# Altium project Speedometer_Tech.PrjPcb
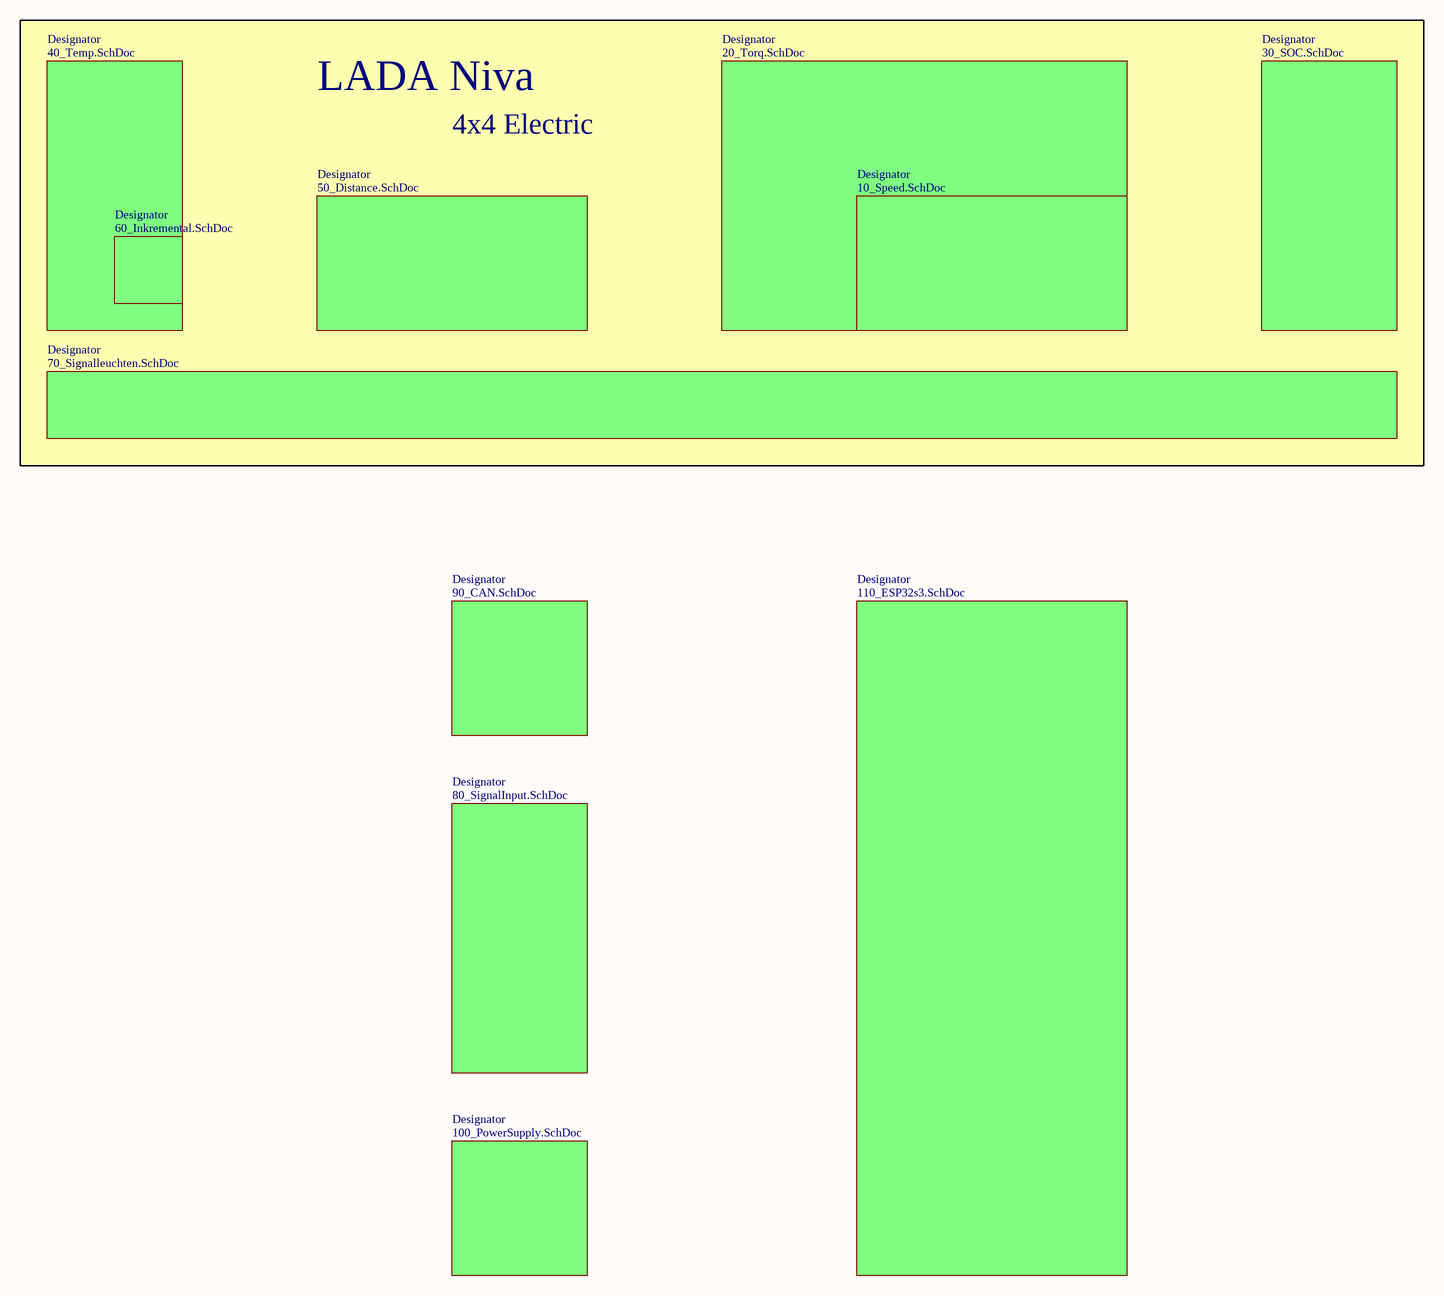
[diagram p0: 00_Overview.SchDoc]
7 sheets, 43 parts. Net scope: flat (ports and power ports of the same name join across sheets).
Board file: Speedometer_Tech.PcbDoc
Sheets:
  00_Overview.SchDoc
    Designator = 110_ESP32s3.SchDoc
    Designator = 10_Speed.SchDoc
    Designator = 40_Temp.SchDoc
    Designator = 50_Distance.SchDoc
    Designator = 100_PowerSupply.SchDoc
    Designator = 90_CAN.SchDoc

## Sheet 00_Overview.SchDoc
size A3; SheetNumber: 1; SheetTotal: 12

### Sub-sheets
Designator = 110_ESP32s3.SchDoc: no entries
Designator = 20_Torq.SchDoc (file not in this document): no entries
Designator = 10_Speed.SchDoc: no entries
Designator = 30_SOC.SchDoc (file not in this document): no entries
Designator = 40_Temp.SchDoc: no entries
Designator = 70_Signalleuchten.SchDoc (file not in this document): no entries
Designator = 50_Distance.SchDoc: no entries
Designator = 60_Inkremental.SchDoc (file not in this document): no entries
Designator = 80_SignalInput.SchDoc (file not in this document): no entries
Designator = 100_PowerSupply.SchDoc: no entries
Designator = 90_CAN.SchDoc: no entries

### Notes on the sheet
- LADA Niva
- 4x4 Electric

## Sheet 110_ESP32s3.SchDoc
size A4; SheetNumber: 12; SheetTotal: 12
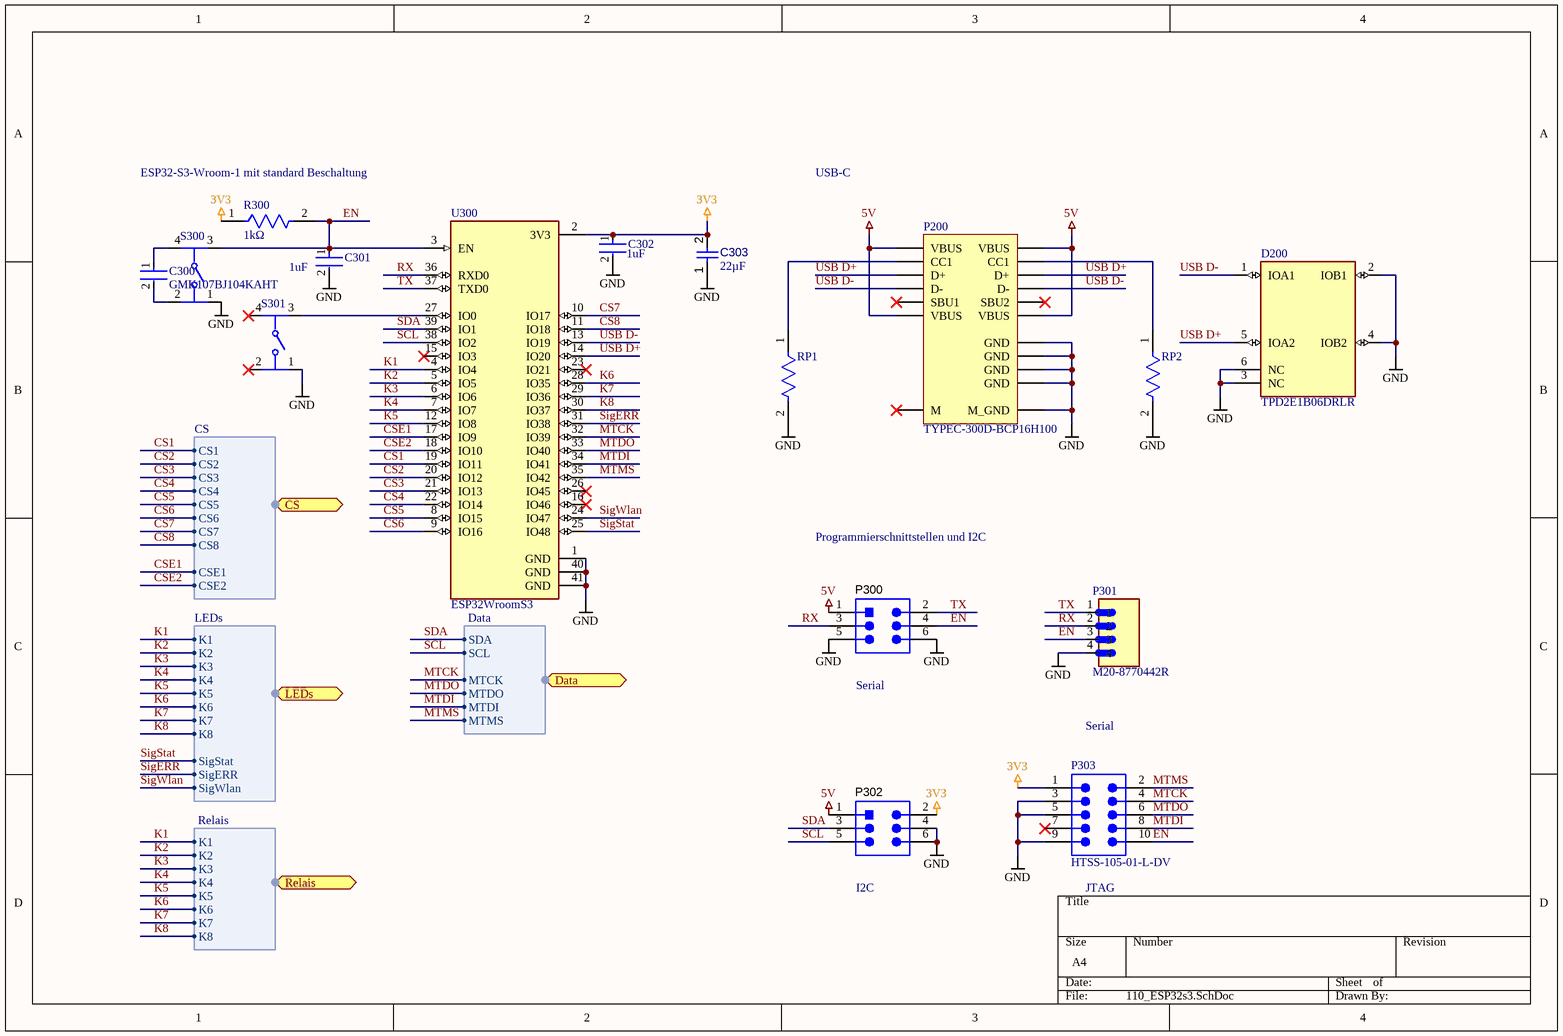
[diagram p1: 110_ESP32s3.SchDoc]

### Parts
C300  GMK107BJ104KAHT  [FP-0603-L_1_6_0_1-W_0_8_0-IPC_B]
C301  1uF  [FP-CGA3E-0_3-0_1-MFG]
C302  1uF  [FP-CGA3E-0_3-0_1-MFG]
C303  value 22µF  [CAPC0805(2012)145_L]  (hidden comment: Capacitor 22µF +/-40% 16V 0805)
D200  TPD2E1B06DRLR  [FP-DRL0006A-MFG]
P200  TYPEC-300D-BCP16H100  [TYPEC-300D-BCP16H100-Footprint-1]
P300  5-146130-2  [TECO-5-146130-2_V]  (value not drawn)
P301  M20-8770442R  [HARWIN_M20-8770442R]
P302  5-146130-2  [TECO-5-146130-2_V]  (value not drawn)
P303  HTSS-105-01-L-DV  [SMTC-HTSS-105-01-X-DV]
R300  1kΩ  [FP-CRCW0603-e3-MFG]
RP1  CRCW06035K10FKEA  [FP-CRCW0603-e3-IPC_C]  (value not drawn)
RP2  CRCW06035K10FKEA  [FP-CRCW0603-e3-IPC_C]  (value not drawn)
S300  (no value)  [FP-PTS645SM43SMTR92LFS-MFG]
S301  (no value)  [FP-PTS645SM43SMTR92LFS-MFG]
U300  ESP32WroomS3  [ESP32WroomS3]

### Ports
CS (bidir, harness CS), Data (bidir, harness Data), LEDs (bidir, harness LEDs), Relais (bidir, harness Relais)

### Harnesses
Relais: K1, K2, K3, K4, K5, K6, K7, K8
LEDs: K1, K2, K3, K4, K5, K6, K7, K8, SigStat, SigERR, SigWlan
CS: CS1, CS2, CS3, CS4, CS5, CS6, CS7, CS8, CSE1, CSE2
Data: SDA, SCL, MTCK, MTDO, MTDI, MTMS

### Nets
3V3: C302.1 C303.2 P302.2 P303.1 R300.1 U300.2(3V3)
5V: P200.A4(VBUS) P200.A9(VBUS) P200.B4(VBUS) P200.B9(VBUS) P300.1 P302.1
GND: C301.2 C302.2 C303.1 D200.2(IOB1) D200.3(NC) D200.4(IOB2) D200.6(NC) P200.A1(GND) P200.A12(GND) P200.B1(GND) P200.B12(GND) P200.M_GND P300.5 P300.6 P301.4 P302.4 P302.6 P303.3 P303.5 P303.9 RP1.2 RP2.2 S300.1 S301.1 U300.1(GND) U300.40(GND) U300.41(GND)
CS1: U300.19(IO11) ; port CS.CS1
CS2: U300.20(IO12) ; port CS.CS2
CS3: U300.21(IO13) ; port CS.CS3
CS4: U300.22(IO14) ; port CS.CS4
CS5: U300.8(IO15) ; port CS.CS5
CS6: U300.9(IO16) ; port CS.CS6
CS7: U300.10(IO17) ; port CS.CS7
CS8: U300.11(IO18) ; port CS.CS8
CSE1: U300.17(IO9) ; port CS.CSE1
CSE2: U300.18(IO10) ; port CS.CSE2
EN: C301.1 P300.4 P301.3 P303.10 R300.2 S300.3 U300.3(EN)
K1: U300.4(IO4) ; port Relais.K1, port LEDs.K1
K2: U300.5(IO5) ; port Relais.K2, port LEDs.K2
K3: U300.6(IO6) ; port Relais.K3, port LEDs.K3
K4: U300.7(IO7) ; port Relais.K4, port LEDs.K4
K5: U300.12(IO8) ; port Relais.K5, port LEDs.K5
K6: U300.28(IO35) ; port Relais.K6, port LEDs.K6
K7: U300.29(IO36) ; port Relais.K7, port LEDs.K7
K8: U300.30(IO37) ; port Relais.K8, port LEDs.K8
MTCK: P303.4 U300.32(IO39) ; port Data.MTCK
MTDI: P303.8 U300.34(IO41) ; port Data.MTDI
MTDO: P303.6 U300.33(IO40) ; port Data.MTDO
MTMS: P303.2 U300.35(IO42) ; port Data.MTMS
RX: P300.3 P301.2 U300.36(RXD0)
SCL: P302.5 U300.38(IO2) ; port Data.SCL
SDA: P302.3 U300.39(IO1) ; port Data.SDA
SigERR: U300.31(IO38) ; port LEDs.SigERR
SigStat: U300.25(IO48) ; port LEDs.SigStat
SigWlan: U300.24(IO47) ; port LEDs.SigWlan
TX: P300.2 P301.1 U300.37(TXD0)
USB D+: D200.5(IOA2) P200.A6(D+) P200.B6(D+) U300.14(IO20)
USB D-: D200.1(IOA1) P200.A7(D-) P200.B7(D-) U300.13(IO19)
NetC300_1: C300.1 S300.4
NetC300_2: C300.2 S300.2
NetP200_A5: P200.A5(CC1) RP1.1
NetP200_B5: P200.B5(CC1) RP2.1
NetS301_3: S301.3 U300.27(IO0)

Not connected (* = marked no-connect by the designer): P200 A8(SBU1)* B8(SBU2)* M*; P303 7*; S301 2* 4*; U300 15(IO3)* 16(IO46)* 23(IO21)* 26(IO45)*

### Notes on the sheet
- (near R300) ESP32-S3-Wroom-1 mit standard Beschaltung
- USB-C
- Programmierschnittstellen und I2C
- (near P300) Serial
- Serial
- (near P302) I2C
- (near P303) JTAG

### Library data of the parts
C300 = CMP-14477-002194-3: Ceramic Capacitor Automotive 0.1uF ±10% 35V X5R 0603; NexarPartId: 29103042; Capacitance: 100nF; Packaging: Digi-Reel®; Height: 900µm; Width: 800µm; Thickness: 889µm; Min Operating Temperature: -55°C; Termination: SMD/SMT; Mount: Surface Mount; Ratings: AEC-Q200; Halogen Free: Halogen Free; Tolerance: 10%; Max Operating Temperature: 85°C; Case Code (Metric): 1608; Case/Package: 0603; Lead Free: Lead Free; Case Code (Imperial): 0603; Length: 1.6002mm; Voltage Rating: 35V; Voltage Rating (DC): 35V; Dielectric: X5R; Min Width: 700µm; Min Length: 1.5mm; Max Length: 1.7mm; Material: Ceramic; Min Thickness: 700µm; Max Thickness: 900µm; RoHS: Compliant; Max Width: 900µm
C301 C302 = CMP-08246-002551-1: Cap Ceramic 1uF 35V X7R 10% Pad SMD 0603 +125°C Automotive T/R / CGA3E1X7R1V105K080AC; Termination: SMD/SMT; Packaging: Tape and Reel; Capacitance: 1uF; Tolerance: 10%; Mount: Surface Mount; Thickness: 0.035inch; Case Code (Imperial): 0603; Voltage Rating: 35V; Case/Package: 0603; Case Code (Metric): 1608; Dielectric: X7R; Width: 0.031inch; Length: 0.063inch; Min Operating Temperature: -55°C; Weight: 7.1E-05oz; Max Operating Temperature: 125°C; Voltage Rating (DC): 35V; Height: 0.8mm; Ratings: AEC-Q200; Package Quantity: 4000
C303 = CMP-001-00081-4: Chip Capacitor, 22µF +/-40%, 16V, 0805, Thickness 1.45 mm; Tolerance: 5%; Voltage Rating: 16V; Mounting Technology: SMT; Pins: 2; Max Operating Temperature: 85°C; Case/Package: 0805; Min Operating Temperature: -55°C
D200 = CMP-04985-000003-1: TVS DIODE 5.5V 15V 6SOT; Manufacturer: Texas Instruments; Peak Pulse Power: 35W; Peak Pulse Current: 2.5A; Direction: Bidirectional; Standoff Height: 0mm; Interface: I2C,USB,LVDS,Other; Number Of Channels: 2; Breakdown Voltage: 7V; Ambient Temperature Range High: +125°C; Package: DRL0006A; Automotive: No; Lead Free: Yes; Temperature Range Low: -40°C; Reverse Standoff Voltage: 5.5V; Clamping Voltage: 15V; Mouser Description: ESD Suppressors / TVS Diodes 2-CH system level ESD protect device; Temperature Range High: +125°C; Device Class L1: Circuit Protection; ComponentLink2Description: Datasheet; RoHS: TRUE; Ambient Temperature Range Low: -40°C; Height: 0.6mm; Device Class L3: unset; Device Class L2: ESD and Circuit Protection ICs; Temperature: -40°C to +125°C; Octopart: https://octopart.com/tpd2e1b06drlr-texas+instruments-30488860; ComponentLink2URL: http://www.ti.com/lit/ds/symlink/tpd2e1b06.pdf; Category: Diode; Manufacturer Part Number: TPD2E1B06DRLR; Digikey Description: TVS DIODE 5.5V 15V 6SOT
P200 = CMP-002-00081-3: Vertical USB Type C Connector
P300 P302 = CMP-1684-00011-1: Male Header, Pitch 2.54 mm, 2 x 3 Position, Height 8.13 mm, -65 to 125 degC, RoHS, Tube; Max Supply Voltage: 5.5 V; Min Supply Voltage: 4.5 V; Nominal Supply Voltage: 5 V; Min Operating Temperature: -40 degC; ComponentLink1URL: http://www.te.com/; ComponentLink2Description: Datasheet; Pins: 3; Max Operating Temperature: 150 degC; PackageDescription: Male Header, Pitch 2.54 mm, 2 x 3 Position, Height 8.13 mm; Package Quantity: 3000; PackageReference: 5-146130-2; DatasheetVersion: Oct-15; ComponentLink1Description: Manufacturer URL; Radiation Hardening: No; Mount: Surface Mount; RoHSCompliant: true; Packaging: Tape and Reel; ComponentLink2URL: http://www.te.com/commerce/DocumentDelivery/DDEController?Action=showdoc&DocId=Customer+Drawing%7F146130%7FM%7Fpdf%7FEnglish%7FENG_CD_146130_M.pdf%7F5-146130-2
P301 = M20-8770442R: Connector Header Surface Mount 4 position 0.100 (2.54mm); MF: Harwin Inc.; Package: None; Price: None; Check_prices: https://www.snapeda.com/parts/M20-8770442R/Harwin+Inc./view-part/?ref=eda; Value: *; SnapEDA_Link: https://www.snapeda.com/parts/M20-8770442R/Harwin+Inc./view-part/?ref=snap; MP: M20-8770442R; Availability: In Stock; Purchase-URL: https://pricing.snapeda.com/search?q=M20-8770442R&ref=eda
P303 = CMP-1024-00042-1: Shrouded .025" SQ Post Header, Surface Mount, Vertical, -55 to 125 degC, 2.54 mm Pitch, 10-Pin, Male, RoHS; Manufacturer: Samtec; Pitch: 2.54 mm; ComponentLink1URL: http://www.samtec.com; Mounting Technology: Surface Mount; ComponentLink3URL: http://www.samtec.com/documents/webfiles/cpdf/HTSS-1XX-01-XX-DV-X-XX-X-XX-MKT.pdf; ComponentLink2URL: http://www.samtec.com/documents/webfiles/pdf/htss.pdf; ComponentLink3Description: Package Specification; Orientation: Vertical; PackageDescription: High Temp Top Shroud; ComponentLink2Description: Datasheet; PackageVersion: Z, 7/2001; ComponentLink1Description: Manufacturer URL; Temperature Range: -55 to 125 degC; RoHS: True; PackageReference: HTSS-105-01-X-DV; DatasheetVersion: F-214; PartNumber: HTSS-105-01-L-DV
R300 = CMP-1666-00003-5: RES Thick Film, 1kΩ, 1%, 0.1W, 100ppm/°C, 0603, CRCW06031K00FKEA; Max Power Dissipation: 100mW; Voltage Rating: 75V; Resistance: 1kR; Max Operating Temperature: 155°C; Number of Pins: 2; Case Code (Imperial): 0603; Width: 0.033inch; Power Rating: 100mW; Number of Terminations: 2; Package Quantity: 10; Weight: 7.1E-05oz; Tolerance: 1%; Temperature Coefficient: 100ppm/°C; Military Standard: Not; Mount: Surface Mount; Voltage Rating (DC): 75V; Depth: 0.85mm; Composition: Thick Film; Radiation Hardening: No; Termination: SMD/SMT; Length: 1.55mm; Case Code (Metric): 1608; Contact Plating: Tin; Min Operating Temperature: -55°C; Packaging: Tape and Reel; Height: 0.45mm; Lead Free: Lead Free; Case/Package: 0603; Features: Automotive AEC-Q200
RP1 RP2 = CMP-1012-00590-3: RES Thick Film, 5.1kΩ, 1%, 0.1W, 100ppm/°C, 0603; Power Rating: 100mW; Voltage Rating (DC): 75V; Resistance: 5.1kR; Width: 0.85mm; Depth: 0.85mm; Military Standard: Not; Package Quantity: 5000; Case Code (Metric): 1608; Length: 1.55mm; Weight: 7.1E-05oz; Packaging: Tape and Reel; Temperature Coefficient: 100ppm/°C; Case Code (Imperial): 0603; Lead Free: Lead Free; Radiation Hardening: No; Contact Plating: Tin; Composition: Thick Film; Max Operating Temperature: 155°C; Termination: SMD/SMT; Case/Package: 0603; Min Operating Temperature: -55°C; Tolerance: 1%; Voltage Rating: 75V; Mount: Surface Mount; Height: 0.45mm
S300 S301 = CMP-2000-05160-2: SWITCH TACTILE SPST-NO 0.05A 12V / PTS645SM43SMTR92LFS; Contact Resistance: 100mR; Throw Configuration: SPST; Illumination Type: Non-Illuminated; Mechanical Life: 100000Cycles; Current Rating: 50mA; Switch Function: Off-Mom; Actuator Length: 0.85mm; Actuator Material: Nylon; Actuator Type: Standard; Operating Force: 160gf; Min Operating Temperature: -20°C; REACH SVHC: No SVHC; Termination: Gull Wing; Case/Package: SMD/SMT; Packaging: Tape and Reel; Mount: Surface Mount; Voltage Rating (DC): 12V; Orientation: Straight; Lead Free: Lead Free; Contact Material: Silver; Color: Black; Max Current Rating: 50mA; Contact Plating: Silver; Depth: 9mm; Package Quantity: 1; Max Voltage Rating (DC): 12V; Length: 6mm; Max Operating Temperature: 60°C
U300 = CMP-017-000002-1: Design Item ID: ESP32WroomS3; Source: Schaltdose.SchLib

## Sheet 10_Speed.SchDoc
size A3; SheetNumber: 2; SheetTotal: 12
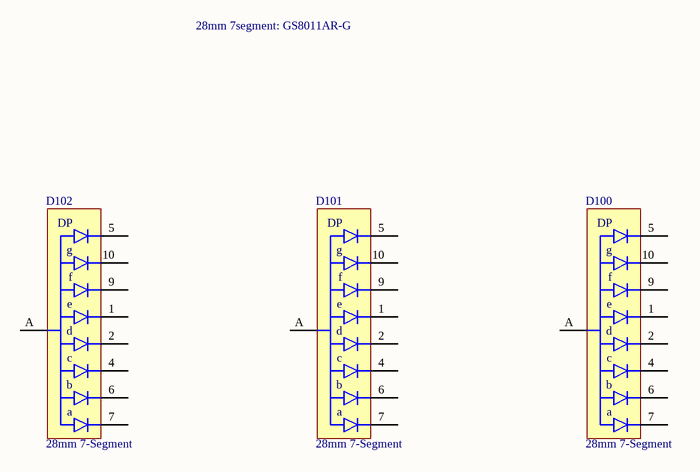
[diagram p2: 10_Speed.SchDoc]

### Parts
D100  28mm 7-Segment  [GS8011AR-G]
D101  28mm 7-Segment  [GS8011AR-G]
D102  28mm 7-Segment  [GS8011AR-G]

### Nets

Not connected (* = marked no-connect by the designer): D100 1 2 4 5 6 7 9 10 A; D101 1 2 4 5 6 7 9 10 A; D102 1 2 4 5 6 7 9 10 A

### Notes on the sheet
- 28mm 7segment: GS8011AR-G

### Library data of the parts
D100-D102 = GS8011AR-G: SMD, 28x16.8mm 7-Segment

## Sheet 40_Temp.SchDoc
size A3; SheetNumber: 5; SheetTotal: 12

## Sheet 50_Distance.SchDoc
size A3; SheetNumber: 6; SheetTotal: 12
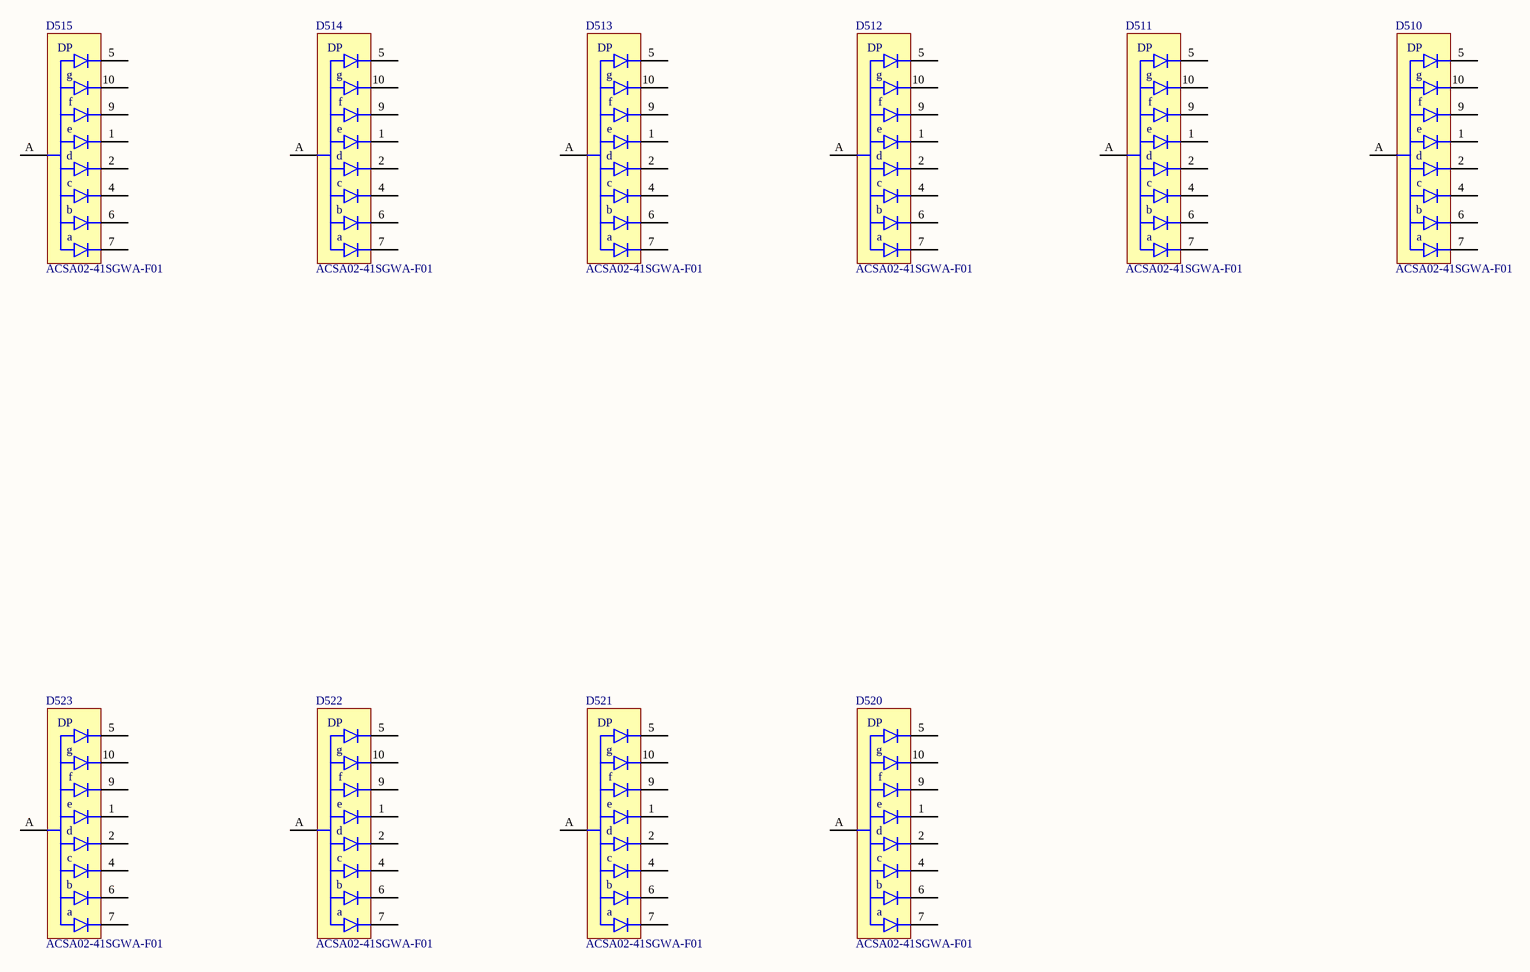
[diagram p3: 50_Distance.SchDoc]

### Parts
D510  ACSA02-41SGWA-F01  [ACSA02-41SGWA-F01]
D511  ACSA02-41SGWA-F01  [ACSA02-41SGWA-F01]
D512  ACSA02-41SGWA-F01  [ACSA02-41SGWA-F01]
D513  ACSA02-41SGWA-F01  [ACSA02-41SGWA-F01]
D514  ACSA02-41SGWA-F01  [ACSA02-41SGWA-F01]
D515  ACSA02-41SGWA-F01  [ACSA02-41SGWA-F01]
D520  ACSA02-41SGWA-F01  [ACSA02-41SGWA-F01]
D521  ACSA02-41SGWA-F01  [ACSA02-41SGWA-F01]
D522  ACSA02-41SGWA-F01  [ACSA02-41SGWA-F01]
D523  ACSA02-41SGWA-F01  [ACSA02-41SGWA-F01]

### Nets

Not connected (* = marked no-connect by the designer): D510 1 2 4 5 6 7 9 10 A; D511 1 2 4 5 6 7 9 10 A; D512 1 2 4 5 6 7 9 10 A; D513 1 2 4 5 6 7 9 10 A; D514 1 2 4 5 6 7 9 10 A; D515 1 2 4 5 6 7 9 10 A; D520 1 2 4 5 6 7 9 10 A; D521 1 2 4 5 6 7 9 10 A; D522 1 2 4 5 6 7 9 10 A; D523 1 2 4 5 6 7 9 10 A

### Notes on the sheet
- (in symbol ACSA02-41SGWA-F01) DP; g; f; e; d; c; b; a

## Sheet 100_PowerSupply.SchDoc
size A3; SheetNumber: 11; SheetTotal: 12

## Sheet 90_CAN.SchDoc
size A4; SheetNumber: 10; SheetTotal: 12
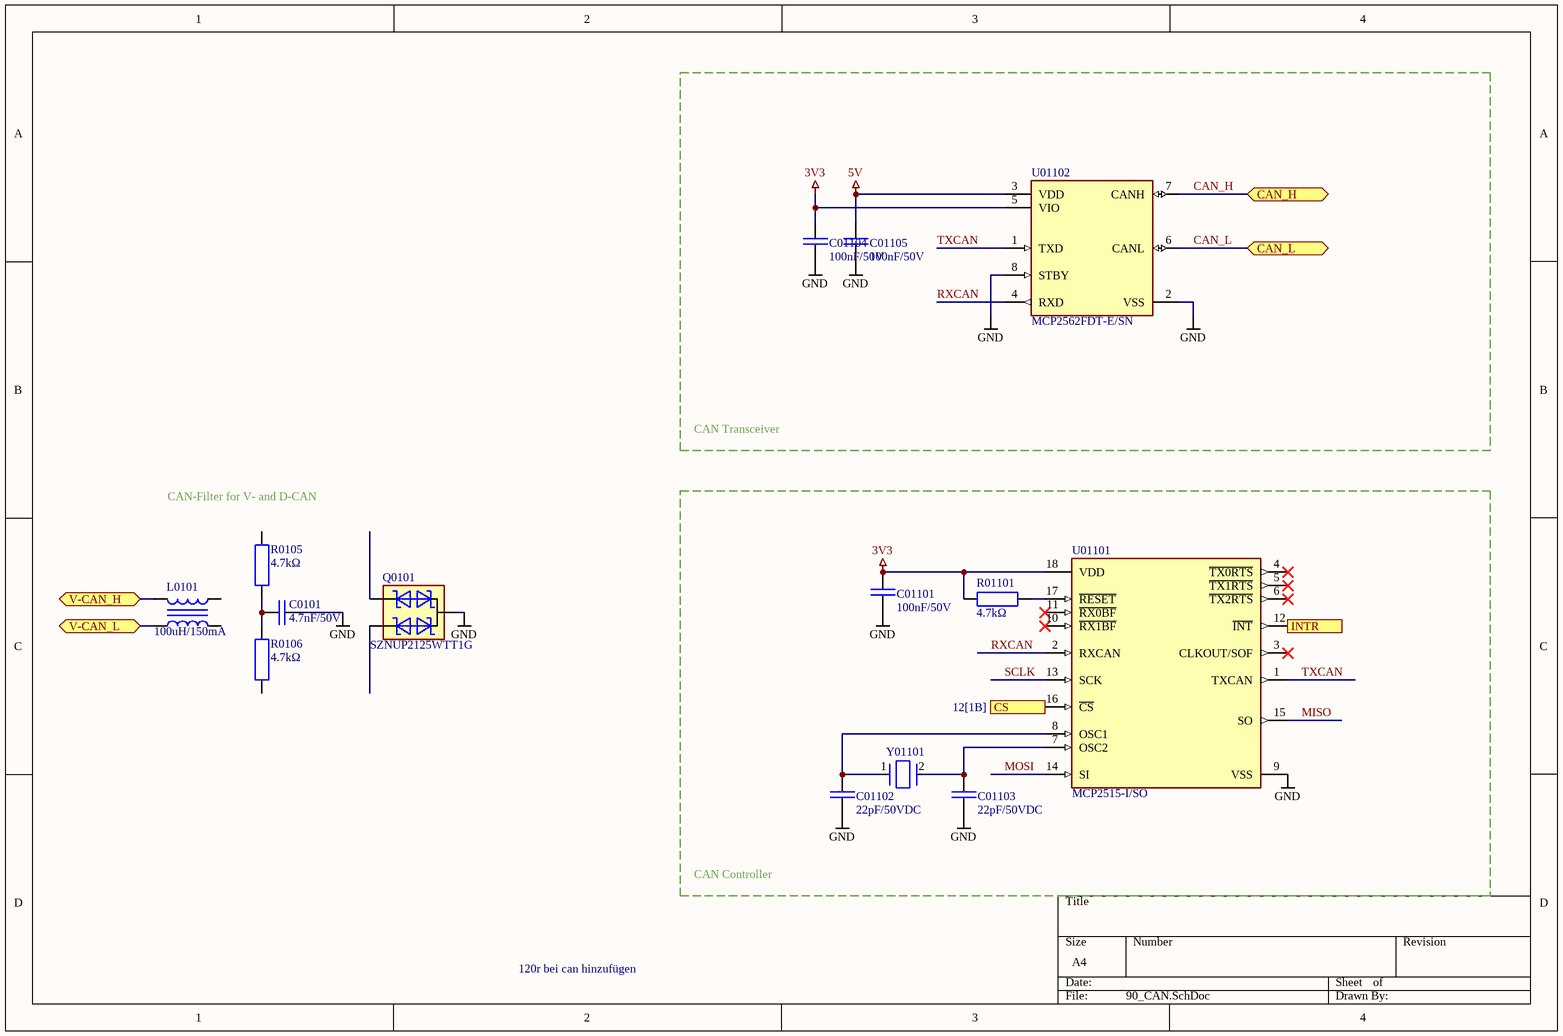
[diagram p4: 90_CAN.SchDoc]

### Parts
C0101  4.7nF/50V  [CS_EIA0603_H1.00]
C01101  100nF/50V  [CS_EIA0603_H0.90]
C01102  22pF/50VDC  [CS_EIA0603_H0.90]
C01103  22pF/50VDC  [CS_EIA0603_H0.90]
C01104  100nF/50V  [CS_EIA0603_H0.90]
C01105  100nF/50V  [CS_EIA0603_H0.90]
L0101  100uH/150mA  [ACT45B_TDK]
Q0101  SZNUP2125WTT1G  [SOT-323_ON_SEMICONDUCTOR]
R0105  4.7kΩ  [RS_EIA1206_H0.70]
R0106  4.7kΩ  [RS_EIA1206_H0.70]
R01101  4.7kΩ  [RS_EIA0603_H0.60]
U01101  MCP2515-I/SO  [FP-C04-051-MFG]
U01102  MCP2562FDT-E/SN  [FP-C04-057-SN-MFG]
Y01101  ABLS-16.000MHZ-K4T  [FP-ABLS-MFG]  (value not drawn)

### Blocks framed on the sheet
CAN Transceiver: C01104 C01105 U01102
CAN Controller: C01101 C01102 C01103 R01101 U01101 Y01101

### Ports
CAN_H (bidir), CAN_L (bidir), CS (in, see 12[1B]), INTR, V-CAN_H (bidir), V-CAN_L (bidir)

### Nets
3V3: C01101.1 C01104.1 R01101.2 U01101.18(VDD) U01102.5(VIO)
5V: C01105.1 U01102.3(VDD)
GND: C0101.2 C01101.2 C01102.1 C01103.1 C01104.2 C01105.2 Q0101.3 U01101.9(VSS) U01102.2(VSS) U01102.8(STBY)
CAN_H: U01102.7(CANH) ; port CAN_H
CAN_L: U01102.6(CANL) ; port CAN_L
MISO: U01101.15(SO)
MOSI: U01101.14(SI)
RXCAN: U01101.2(RXCAN) U01102.4(RXD)
SCLK: U01101.13(SCK)
TXCAN: U01101.1(TXCAN) U01102.1(TXD)
NetC0101_1: C0101.1 R0105.1 R0106.1
NetC01102_2: C01102.2 U01101.8(OSC1) Y01101.1
NetC01103_2: C01103.2 U01101.7(OSC2) Y01101.2
NetL0101_1: L0101.1 ; port V-CAN_L
NetL0101_2: L0101.2 ; port V-CAN_H
NetR01101_1: R01101.1 U01101.17(~{RESET})
NetU01101_12: U01101.12(~{INT}) ; port INTR
NetU01101_16: U01101.16(~{CS}) ; port CS

Not connected (* = marked no-connect by the designer): L0101 3 4; Q0101 1 2; R0105 2; R0106 2; U01101 3(CLKOUT/SOF)* 4(~{TX0RTS})* 5(~{TX1RTS})* 6(~{TX2RTS})* 10(~{RX1BF})* 11(~{RX0BF})*

### Notes on the sheet
- (near R0105) CAN-Filter for V- and D-CAN
- 120r bei can hinzufügen

### Library data of the parts
C0101 = 2132: Part Number: 2132; Manufacturer Part Number: C0603C472K5RACAUTO; Part Number Inovance: 05025154; LibCare Control and Release: eha, 06.02.2019; LibCare Create: dz, 09.10.2018; Text Field1: 10747; AAA-Component Name: CS_0603_4N7/50VDC/X7R/10%/Q_KEMET; Component Category: Capacitor; HelpURL: d3:P000037793; Comment Text: 4.7nF/50V
C01101 C01104 C01105 = 4686: Part Number: 4686; Manufacturer Part Number: AC0603KRX7R9BB104; Manufacturer: YAGEO; Part Number Inovance: 05025071; LibCare Control and Release: pr, 27.10.2021; LibCare Create: ct, 31.08.2021; Text Field1: 1001083; AAA-Component Name: CS_0603_100N/50V/X7R/10%/Q2_AC0603KRX7R9BB104_YAGEO; Component Category: Capacitor; HelpURL: d3:P000478103; Comment Text: 100nF/50V
C01102 C01103 = 3844: Part Number: 3844; Manufacturer Part Number: GCM1885C1H220JA16D; Manufacturer: MURATA; Part Number Inovance: 05025109; LibCare Control and Release: jsv01, 06.09.2022; LibCare Create: Illya L., 16.08.2022        ,ema11; Text Field1: 23395; AAA-Component Name: CS_0603_22P/5%/Q1_GCM-SERIES_TDK; Component Category: Capacitor; HelpURL: d3:P000478318; Comment Text: 22pF/50VDC
L0101 = 2761: Part Number: 2761; Manufacturer Part Number: ACT45B-101-2P-TL003; Part Number Inovance: 11030065; Component Category: Inductor; LibCare Control and Release: kp, 28.07.2020; LibCare Create: dz, 27.07.2020; Text Field1: 20939; AAA-Component Name: LS_100U/150mA_ACT45B_TDK; HelpURL: d3:P000362946; Comment Text: 100uH/150mA
Q0101 = 3643: Part Number: 3643; Part Number Inovance: 06016365; Manufacturer: ONSEMI; Component Category: Suppressor Diode; LibCare Create: pr, 22.06.2022; AAA-Component Name: ZS_SZNUP2125WTT1G_ONSEMI; Text Field1: IA; LibCare Control and Release: rde01, 15.09.2022; HelpURL: d3:P000; Manufacturer Part Number: SZNUP2125WTT1G; Comment Text: SZNUP2125WTT1G
R0105 R0106 = AC1206FR-074K7L: SMD 4.7 kOhms 250 mW 1206 1%; Part Number Inovance: 04027487; Manufacturer: YAGEO; AAA-Component Name: RS_1206_4.7K/1%/Q_AC_YAGEO; LibCare Control and Release: rde01, 15.09.2022; Text Field1: IA; Comment Text: 4.7kΩ; Manufacturer Part Number: AC1206FR-074K7L
R01101 = 3222: Part Number: 3222; Manufacturer Part Number: AC0603FR-074K7L; Manufacturer: YAGEO; Part Number Inovance: 04027354; LibCare Control and Release: pr, 02.11.2021; LibCare Create: ct, 02.09.2021; Text Field1: 23321; AAA-Component Name: RS_0603_4K7/1%/Q2_AC-SERIES_YAGEO; Component Category: Resistor; HelpURL: d3:P000477738; Comment Text: 4.7kΩ
U01101 = CMP-0186-00133-3: IC CAN CONTROLLER W/SPI 18SOIC; Manufacturer: Microchip; Min Supply Voltage: 2.7V; Max Supply Voltage: 5.5V; Standoff Height: 0.1mm; Nominal Supply Current: 10mA; Interface: SPI,CAN; Lead Free: Yes; Digikey Description: IC CAN CONTROLLER W/SPI 18SOIC; Category: IC; RoHS: TRUE; Manufacturer Part Number: MCP2515-I/SO; ComponentLink2URL: http://ww1.microchip.com/downloads/en/DeviceDoc/MCP2515-Stand-Alone-CAN-Controller-with-SPI-20001801J.pdf; Mouser Description: CAN Interface IC W/ SPI Interface; Device Class L2: Interface ICs; Package: C04-051; Automotive: No; Function: Controller; Octopart: https://octopart.com/mcp2515-i%2Fso-microchip-430187; Temperature: -40°C to +85°C; Ipc Land Pattern Name: SOIC127P1030X265-18; Ambient Temperature Range Low: -65°C; Height: 2.65mm; Device Class L1: Integrated Circuits (ICs); Ambient Temperature Range High: +125°C; Footprint Url: http://ww1.microchip.com/downloads/en/DeviceDoc/18L_SOIC_Wide_7.50_SO_C04-0051D.pdf; Temperature Range Low: -40°C; Device Class L3: Controllers; Temperature Range High: +85°C; ComponentLink2Description: Datasheet
U01102 = CMP-06279-000005-1: IC TRANSCEIVER 1/1 8SOIC; Operating Supply Current: 70mA; Data Rate: 8Mbps; Number of Transceivers: 1; Receiver Hysteresis: 200mV; Max Supply Voltage: 5.5V; Min Supply Voltage: 4.5V; Weight: 0.019048oz; Package Quantity: 3300; Case/Package: SOIC; Mount: Surface Mount; Max Operating Temperature: 125°C; Min Operating Temperature: -40°C; Packaging: Tape and Reel; Number of Pins: 8
Y01101 = CMP-27762-000003-1: CRYSTAL 16.0000MHZ 18PF SMD; Manufacturer: Abracon; Frequency: 16MHz; Stability: 50ppm; Tolerance: 30ppm; Standoff Height: 0mm; Esr: 40Ω; ComponentLink2URL: https://abracon.com/Resonators/abls.pdf; Temperature Range High: +125°C; Package: ABLS; Device Class L3: Crystals; Temperature: -40°C to +125°C; Load Capacitance: 18pF; Device Class L2: Crystals / Oscillators; Mouser Description: Crystal 16MHz ±30ppm (Tol) ±50ppm (Stability) 18pF FUND 40Ohm 2-Pin HC-49/US SMD T/R; Category: Crys; ComponentLink2Description: Datasheet; Manufacturer Part Number: ABLS-16.000MHZ-K4T; Series: ABLS; Automotive: No; Octopart: https://octopart.com/abls-16.000mhz-k4t-abracon-18618626; RoHS: TRUE; Digikey Description: CRYSTAL 16.0000MHZ 18PF SMD; Temperature Range Low: -40°C; Lead Free: Yes; Height: 4.3mm; Device Class L1: Passive Components

## Nets that join several sheets
3V3: 110_ESP32s3 (6 pins), 90_CAN (5 pins)
5V: 110_ESP32s3 (6 pins), 90_CAN (C01105.1 U01102.3)
GND: 110_ESP32s3 (27 pins), 90_CAN (10 pins)